# EAGLE board E8-C (EAGLE 6.6.0), part 1 of 2
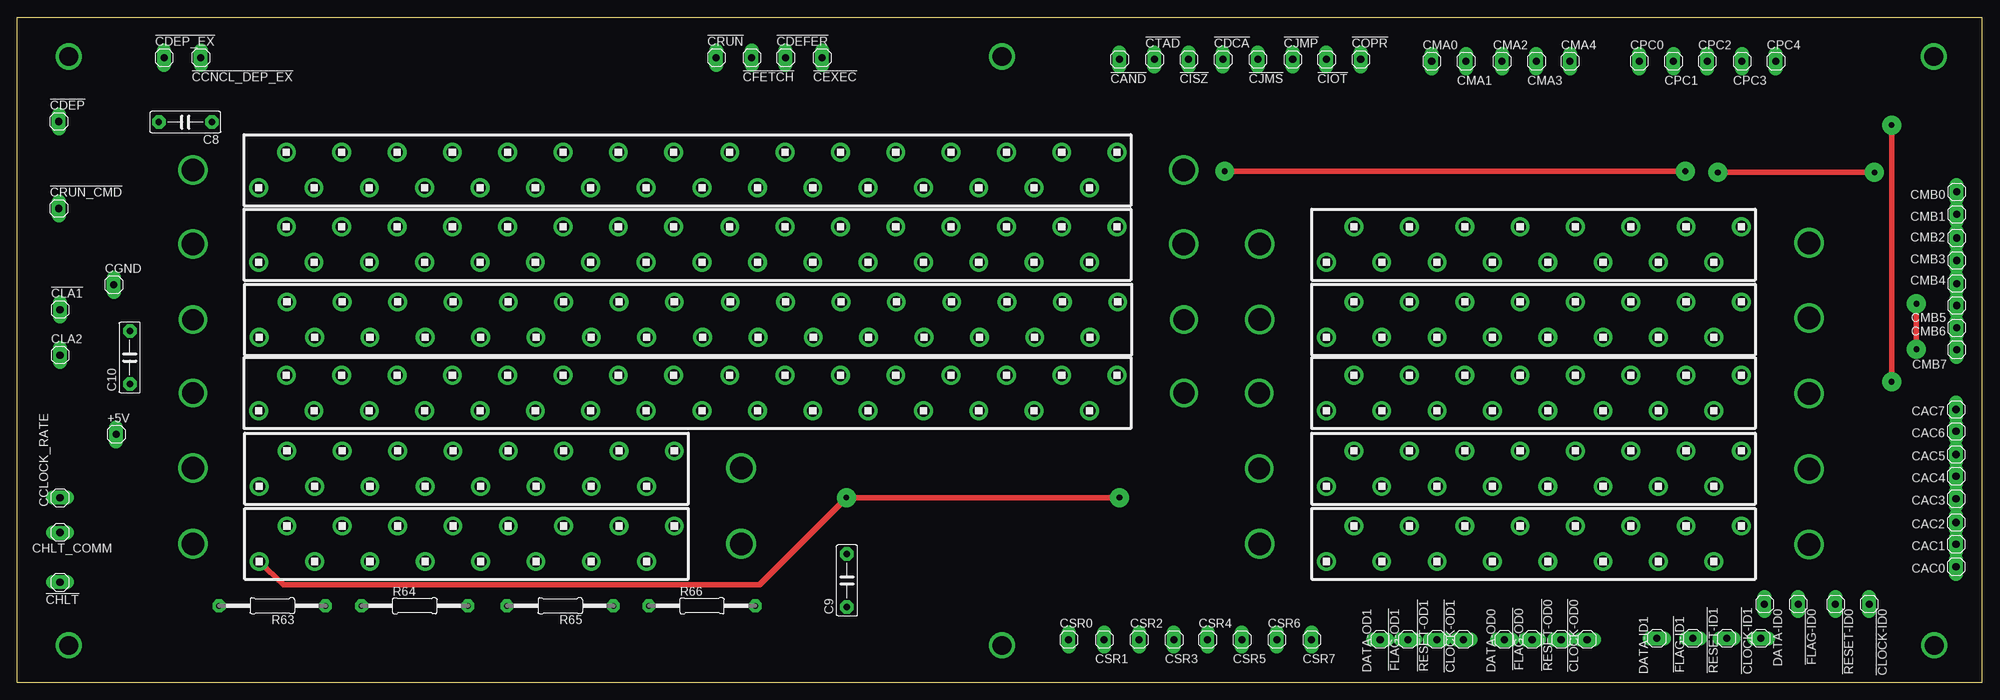
[diagram p1: board, top side]
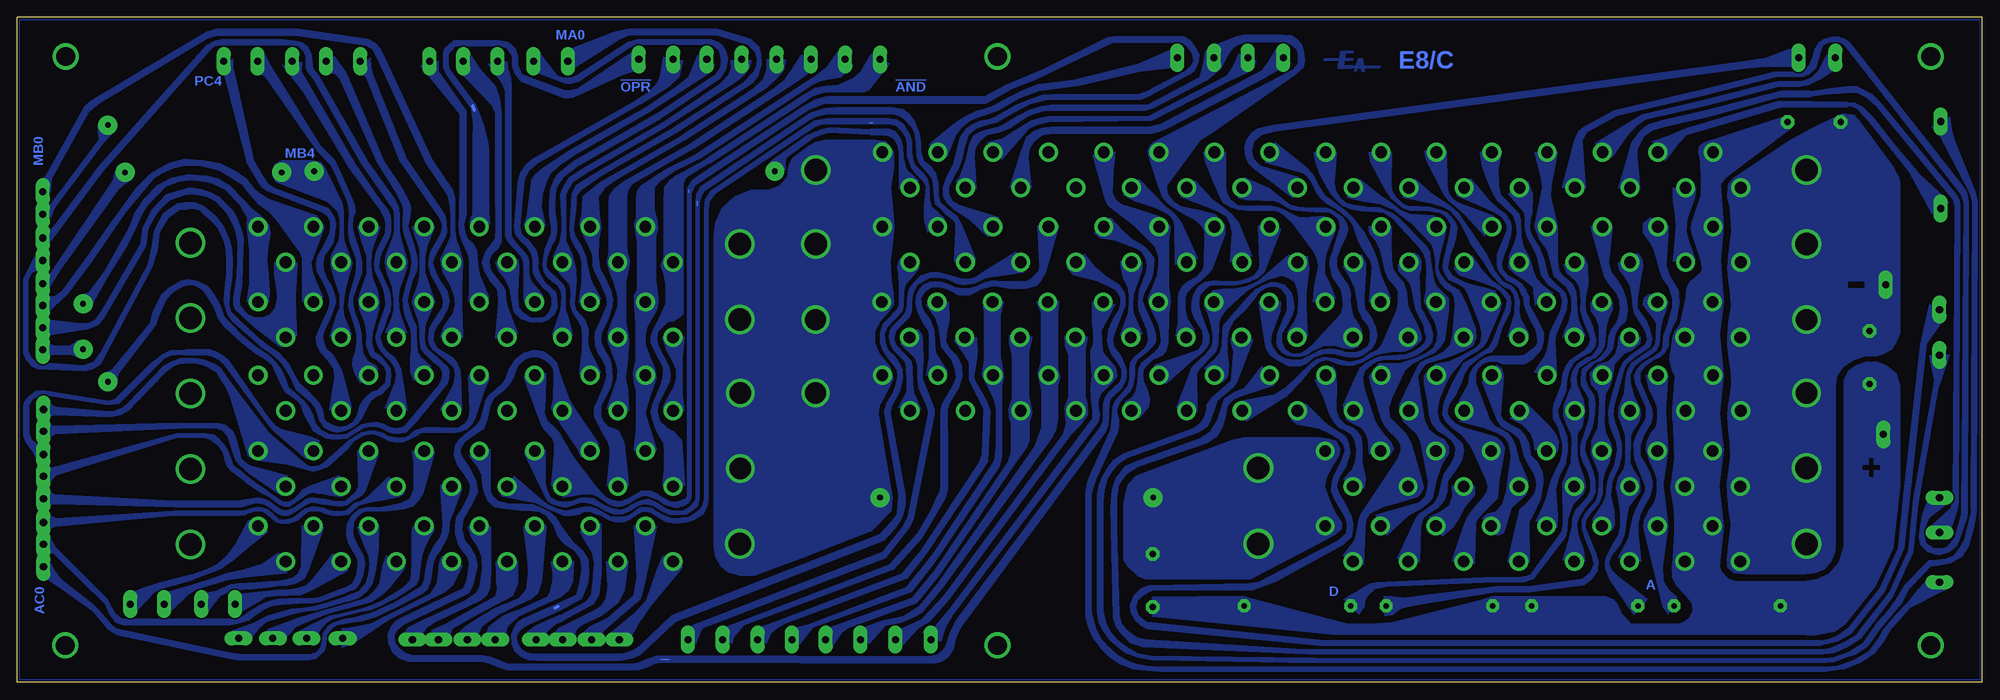
[diagram p2: board, bottom side, seen from below]

Size 281.35 x 95.17 mm. Coordinates in mm from the lower left corner, seen from the top.
Outline: 0,0 281.35,0 281.35,95.17 0,95.17 0,0
Outline: 0,0 0,0
Copper layers (1*16): Top 0.035mm / dielectric 1.5mm / Bottom 0.035mm
Design rules "default *": minimum track width 3mil, minimum drill 32mil, track to track 8mil, track to pad 8mil, pad to pad 8mil, via to via 8mil, smd to smd 8mil, copper to edge 10mil, drill to drill 8mil, minimum pad ring 20mil, minimum via ring 8mil, stop-mask expansion 4mil, vias tented up to drill 0mil, thermal gap 10mil

## Footprints (pad centres in the part's own frame; a part is rotated, then mirrored left to right if it is on the bottom)
MA01-1 = drill 1.016 long: 1 0,0
C075-032X103 = drill 0.914 octagon: 1 -3.81,0; 2 3.81,0
133-12-17 = drill 1.676: 1 -29.718,-2.54; 2 -25.756,2.54; 3 -21.793,-2.54; 4 -17.831,2.54; 5 -13.868,-2.54; 6 -9.906,2.54; 7 -5.944,-2.54; 8 -1.981,2.54; 9 1.981,-2.54; 10 5.944,2.54; 11 9.906,-2.54; 12 13.868,2.54; 13 17.831,-2.54; 14 21.793,2.54; 15 25.756,-2.54; 16 29.718,2.54
133-14-17 = drill 1.676: 1 -61.468,-2.54; 2 -57.506,2.54; 3 -53.543,-2.54; 4 -49.581,2.54; 5 -45.618,-2.54; 6 -41.656,2.54; 7 -37.694,-2.54; 8 -33.731,2.54; 9 -29.769,-2.54; 10 -25.806,2.54; 11 -21.844,-2.54; 12 -17.882,2.54; 13 -13.919,-2.54; 14 -9.957,2.54; 15 -5.994,-2.54; 16 -2.032,2.54; 17 2.032,-2.54; 18 5.994,2.54; 19 9.957,-2.54; 20 13.919,2.54; 21 17.882,-2.54; 22 21.844,2.54; 23 25.806,-2.54; 24 29.769,2.54; 25 33.731,-2.54; 26 37.694,2.54; 27 41.656,-2.54; 28 45.618,2.54; 29 49.581,-2.54; 30 53.543,2.54; 31 57.506,-2.54; 32 61.468,2.54
0207/15 = drill 0.813 octagon: 1 -7.62,0; 2 7.62,0

## Placement (x,y rotation side)
!CAND  MA01-1  [MA01-1]  157.82,89.15 0 top
!CCNCL_DEP_EX  MA01-1  [MA01-1]  26.25,89.41 0 top
!CDCA  MA01-1  [MA01-1]  172.64,89.15 0 top
!CDEFER  MA01-1  [MA01-1]  109.98,89.41 0 top
!CDEP  MA01-1  [MA01-1]  5.93,80.26 0 top
!CDEP_EX  MA01-1  [MA01-1]  21,89.41 0 top
!CEXEC  MA01-1  [MA01-1]  115.23,89.41 0 top
!CFETCH  MA01-1  [MA01-1]  105.16,89.41 0 top
!CHLT  MA01-1  [MA01-1]  6.1,14.31 90 top
!CIOT  MA01-1  [MA01-1]  187.45,89.15 0 top
!CISZ  MA01-1  [MA01-1]  167.72,89.15 0 top
!CJMP  MA01-1  [MA01-1]  182.63,89.15 0 top
!CJMS  MA01-1  [MA01-1]  177.63,89.15 0 top
!CLA1  MA01-1  [MA01-1]  6.1,53.34 0 top
!CLOCK-ID0  MA01-1  [MA01-1]  265.18,11.18 0 top
!CLOCK-ID1  MA01-1  [MA01-1]  249.68,6.27 270 top
!CLOCK-OD0  MA01-1  [MA01-1]  224.79,6.1 270 top
!CLOCK-OD1  MA01-1  [MA01-1]  207.09,6.1 270 top
!COPR  MA01-1  [MA01-1]  192.36,89.15 0 top
!CRUN  MA01-1  [MA01-1]  100.08,89.41 0 top
!CRUN_CMD  MA01-1  [MA01-1]  5.93,67.82 0 top
!CTAD  MA01-1  [MA01-1]  162.81,89.15 0 top
!FLAG-ID0  MA01-1  [MA01-1]  255.02,11.18 0 top
!FLAG-ID1  MA01-1  [MA01-1]  239.95,6.27 270 top
!FLAG-OD0  MA01-1  [MA01-1]  216.92,6.1 270 top
!FLAG-OD1  MA01-1  [MA01-1]  199.14,6.1 270 top
!RESET-ID0  MA01-1  [MA01-1]  260.35,11.18 0 top
!RESET-ID1  MA01-1  [MA01-1]  244.77,6.27 270 top
!RESET-OD0  MA01-1  [MA01-1]  221.06,6.1 270 top
!RESET-OD1  MA01-1  [MA01-1]  203.28,6.1 270 top
+5V  MA01-1  [MA01-1]  14.14,35.48 0 top
C8  0.1uF  [C075-032X103]  24.05,80.18 180 top
C9  0.1uF  [C075-032X103]  118.79,14.56 90 top
C10  0.1uF  [C075-032X103]  16.09,46.48 90 top
CAC0  MA01-1  [MA01-1]  277.62,16.51 0 top
CAC1  MA01-1  [MA01-1]  277.62,19.73 0 top
CAC2  MA01-1  [MA01-1]  277.62,22.86 0 top
CAC3  MA01-1  [MA01-1]  277.62,26.25 0 top
CAC4  MA01-1  [MA01-1]  277.62,29.46 0 top
CAC5  MA01-1  [MA01-1]  277.62,32.6 0 top
CAC6  MA01-1  [MA01-1]  277.62,35.9 0 top
CAC7  MA01-1  [MA01-1]  277.62,39.03 0 top
CCLOCK_RATE  MA01-1  [MA01-1]  6.1,26.42 90 top
CGND  MA01-1  [MA01-1]  13.8,56.9 0 top
CHLT_COMM  MA01-1  [MA01-1]  6.1,21.42 270 top
CLA2  MA01-1  [MA01-1]  6.1,46.82 0 top
CMA0  MA01-1  [MA01-1]  202.52,88.9 0 top
CMA1  MA01-1  [MA01-1]  207.43,88.9 0 top
CMA2  MA01-1  [MA01-1]  212.6,88.9 0 top
CMA3  MA01-1  [MA01-1]  217.51,88.9 0 top
CMA4  MA01-1  [MA01-1]  222.33,88.9 0 top
CMB0  MA01-1  [MA01-1]  277.71,70.19 0 top
CMB1  MA01-1  [MA01-1]  277.71,66.97 0 top
CMB2  MA01-1  [MA01-1]  277.71,63.58 0 top
CMB3  MA01-1  [MA01-1]  277.71,60.37 0 top
CMB4  MA01-1  [MA01-1]  277.71,57.07 0 top
CMB5  MA01-1  [MA01-1]  277.71,53.93 0 top
CMB6  MA01-1  [MA01-1]  277.71,50.72 0 top
CMB7  MA01-1  [MA01-1]  277.71,47.58 0 top
CPC0  MA01-1  [MA01-1]  232.24,88.9 0 top
CPC1  MA01-1  [MA01-1]  237.15,88.9 0 top
CPC2  MA01-1  [MA01-1]  241.98,88.9 0 top
CPC3  MA01-1  [MA01-1]  246.97,88.9 0 top
CPC4  MA01-1  [MA01-1]  251.8,88.9 0 top
CSR0  MA01-1  [MA01-1]  150.54,6.1 0 top
CSR1  MA01-1  [MA01-1]  155.62,6.1 0 top
CSR2  MA01-1  [MA01-1]  160.61,6.1 0 top
CSR3  MA01-1  [MA01-1]  165.61,6.1 0 top
CSR4  MA01-1  [MA01-1]  170.43,6.1 0 top
CSR5  MA01-1  [MA01-1]  175.34,6.1 0 top
CSR6  MA01-1  [MA01-1]  180.34,6.1 0 top
CSR7  MA01-1  [MA01-1]  185.34,6.1 0 top
DATA-ID0  MA01-1  [MA01-1]  250.19,11.18 0 top
DATA-ID1  MA01-1  [MA01-1]  234.78,6.27 270 top
DATA-OD0  MA01-1  [MA01-1]  212.94,6.1 270 top
DATA-OD1  MA01-1  [MA01-1]  195.16,6.1 270 top
E8/10T  MCMURDO-16  [133-12-17]  64.35,19.81 0 top
E8/10T-2  MCMURDO-16  [133-12-17]  217.17,19.81 0 top
E8/A  MCMURDO-16  [133-12-17]  64.35,30.56 0 top
E8/A-2  MCMURDO-16  [133-12-17]  217.17,30.56 0 top
E8/D  MCMURDO-32  [133-14-17]  96.01,62.65 0 top
E8/D-2  MCMURDO-16  [133-12-17]  217.17,62.65 0 top
E8/M  MCMURDO-32  [133-14-17]  96.1,51.9 0 top
E8/M-2  MCMURDO-16  [133-12-17]  217.17,51.9 0 top
E8/P  MCMURDO-32  [133-14-17]  96.01,41.4 0 top
E8/P-2  MCMURDO-16  [133-12-17]  217.17,41.4 0 top
E8/T  MCMURDO-32  [133-14-17]  96.01,73.32 0 top
R63  680  [0207/15]  36.49,10.92 180 top
R64  680  [0207/15]  56.9,10.92 0 top
R65  4700  [0207/15]  77.72,10.92 180 top
R66  4700  [0207/15]  98.04,10.92 0 top

## Tracks (layer width: path | path; a pad name or v marks a point on that pad's centre or on a via)
!CAND
  pour Bottom (no thermals): 182.12,74.34 168.49,83.23 167.56,83.9 166.37,84.33 165.44,84.5 160.1,84.5 159.43,84.84 156.46,88.56 159.09,89.92 160.61,87.29 161.63,86.44 163.75,85.43 165.52,85.34 167.13,85.01 168.99,83.9 182.88,74.76
  pour Bottom (no thermals): 188.98,28.19 188.81,29.29 188.64,30.65 188.64,33.1 188.72,34.21 189.4,35.22 189.99,36.41 190.42,37.68 190.58,38.61 190.42,39.62 189.31,42.25 188.89,43.52 188.81,44.37 188.81,45.04 189.4,46.14 190.33,47.92 190.58,48.51 190.58,49.36 190.42,50.12 189.57,51.73 189.06,52.92 188.47,54.19 188.47,56.98 188.72,58.42 189.15,59.69 188.72,60.88 188.72,68.66 188.64,70.87 187.88,71.88 186.94,72.56 182.88,74.76 182.12,74.34 183.98,73.32 185.59,72.31 186.01,71.46 186.01,52.75 186.61,52.15 187.45,51.65 188.38,51.48 189.74,50.12 189.82,49.02 189.57,48.09 188.13,45.21 187.88,44.2 187.96,43.1 189.65,39.62 189.74,38.61 189.4,37.34 188.55,36.58 187.54,35.98 186.27,34.63 185.84,28.11
!CCNCL_DEP_EX
  pour Bottom (no thermals): 98.64,69.26 104.14,73.41 105.07,74.34 105.49,75.52 105.58,76.62 105.24,77.64 104.56,78.66 103.63,79.33 101.85,79.76 33.7,88.98 30.99,89.41 27.77,90.59 26.33,90.85 26.67,88.05 30.9,88.14 34.04,87.8 101.43,78.82 103.29,78.32 104.31,77.39 104.65,76.12 104.39,75.01 103.63,74.17 103.04,73.83 97.96,72.39
!CDCA
  pour Bottom (no thermals): 185.76,77.64 173.99,85.17 172.47,86.61 171.53,87.71 171.28,89.07 174.07,89.15 174.07,87.71 174.67,86.19 176.02,84.92 186.27,78.23
  pour Bottom (no thermals): 196.93,28.02 196.51,32.17 196.51,33.53 196.77,34.46 197.53,35.73 198.2,37 198.71,38.1 198.71,39.37 198.2,40.39 197.36,42.33 196.93,43.86 197.02,45.13 197.53,46.23 198.2,47.16 198.54,48.18 198.63,49.53 198.54,50.12 197.53,52.41 196.85,54.02 196.93,55.03 197.27,55.88 197.87,57.15 198.54,58.59 198.88,59.52 198.88,60.79 199.05,61.38 199.47,62.48 200.07,63.5 200.83,65.53 200.49,66.97 200.32,69.6 197.7,71.71 186.27,78.23 185.76,77.64 195.41,72.05 197.27,70.78 198.2,69.43 198.04,66.97 197.78,65.02 198.12,63.5 198.2,60.88 197.95,59.18 197.19,57.83 196.43,56.05 196.09,54.69 196.26,53.59 196.93,51.65 197.78,49.95 197.87,48.77 197.36,47.58 196.51,46.14 196.26,44.87 196.17,43.43 196.43,42.33 196.85,41.4 197.87,39.54 197.87,38.1 197.44,37.25 196.77,36.58 195.92,36.32 195.33,36.07 194.9,35.22 194.48,34.21 193.8,28.19
!CDEFER
  pour Bottom (no thermals): 98.3,87.04 97.11,88.14 96.94,89.07 97.11,90.34 97.37,91.27 98.13,92.03 98.89,92.54 100.08,92.63 105.75,92.63 106.76,92.37 110.49,90.93 111.25,90.17 111.51,88.73 111.84,87.29 112.1,86.61 111,86.19 108.88,88.05 108.03,89.66 107.27,90.85 106.51,91.36 105.41,91.69 99.82,91.69 98.98,91.36 98.21,90.68 97.96,90 97.96,88.56 98.38,87.97 98.64,87.71
  pour Bottom (no thermals): 112.78,50.38 113.71,51.9 114.05,53.17 114.05,55.12 113.71,55.96 112.95,56.73 111.84,57.57 110.83,58.5 110.24,59.18 108.37,64.18 108.37,65.36 109.81,66.89 112.18,67.56 114.72,68.07 115.82,68.75 116.67,69.93 116.76,71.12 111.93,77.64 109.98,78.91 98.3,87.04 98.64,87.71 118.7,77.22 119.21,76.71 119.55,76.12 119.38,75.27 118.03,71.04 117.43,69.6 116.67,68.66 115.99,68.16 115.15,67.56 113.79,66.8 112.78,66.29 111.93,65.53 111.68,65.11 111.34,64.35 111.42,59.61 111.76,58.76 112.52,58 113.88,57.23 114.64,56.56 115.06,55.71 115.15,54.69 115.15,51.56 115.49,49.61
  pour Bottom (no thermals): 146.98,71.63 146.39,72.31 145.46,74.85 145.03,76.96 144.44,78.23 143.59,78.74 142.75,79.08 140.89,79.5 139.19,80.35 137.92,81.2 136.4,81.96 134.79,82.47 133.43,82.63 119.55,82.63 112.1,86.61 111,86.19 118.79,82.13 119.8,81.79 134.2,81.79 135.64,81.36 136.91,80.86 139.36,79.25 140.8,78.66 142.58,78.32 143.68,77.39 144.19,76.45 144.36,75.35 144.1,70.61
!CDEP
  pour Bottom (no thermals): 104.39,49.11 106.76,42.84 107.36,42.16 109.56,40.3 109.9,39.2 110.57,37.34 111,36.58 112.27,35.73 122.68,32 123.7,31.24 124.54,30.31 125.31,29.13 125.73,27.43 125.9,25.99 125.9,10.08 125.56,8.55 124.8,7.11 123.78,6.01 122.68,5.16 120.9,4.15 119.04,3.81 95.59,3.47 22.44,3.39 22.44,2.79 99.31,2.79 118.96,3.13 120.82,3.47 122.43,4.06 123.61,4.91 124.88,6.01 125.9,7.54 126.41,8.47 126.66,9.91 126.66,26.59 126.49,27.94 126.07,29.21 125.22,30.65 124.38,31.75 122.85,32.77 112.78,36.41 111.84,37.17 111.34,37.85 111,39.03 111,39.71 110.32,40.72 107.53,43.18 107.44,43.94 107.1,47.33 107.61,49.19
  pour Bottom (no thermals): 22.44,3.39 21.34,3.56 18.88,4.4 16.93,5.67 14.9,8.55 13.38,10.33 12.28,11.77 11.01,13.97 7.54,17.44 6.52,17.53 5.16,17.7 3.98,18.2 3.13,19.22 2.46,20.32 2.03,22.18 1.44,24.38 1.52,24.89 1.35,68.66 1.61,69.85 5.16,76.71 6.01,78.23 7.2,79.5 4.66,80.94 4.4,79.08 3.98,77.55 1.02,70.27 0.68,68.75 0.85,24.38 1.19,22.27 1.95,19.47 2.96,17.86 4.49,17.02 6.27,16.68 7.45,16.51 8.21,15.75 10.58,13.29 11.51,11.35 14.65,7.62 15.92,5.76 16.59,5 18.2,3.89 19.81,3.39 21.25,2.88 22.44,2.79
!CDEP_EX
  pour Bottom (no thermals): 55.37,77.13 50.38,80.26 48.6,81.28 39.45,83.48 29.38,86.02 25.91,86.02 24.3,86.61 23.37,87.55 22.27,89.83 20.07,88.39 23.03,86.36 24.89,85.43 26.59,85.17 29.13,85.26 39.45,82.55 48.26,80.52 49.61,79.59 50.63,78.49 53,75.18
!CEXEC
  pour Bottom (no thermals): 148.17,75.27 146.9,78.49 146.13,79.42 144.86,80.43 143.68,80.94 142.49,81.28 140.8,81.96 139.53,82.63 138.01,83.57 135.13,84.67 129.29,85.43 120.65,87.46 114.98,88.14 115.74,90.68 120.9,88.48 130.05,86.19 135.3,85.51 137.67,84.5 139.28,83.74 141.48,82.55 142.83,82.04 144.02,81.7 145.88,80.77 147.4,79.76 150.79,76.96
!CFETCH
  pour Bottom (no thermals): 142.49,77.3 140.21,77.89 137.33,79.67 136.06,80.43 134.79,80.77 133.77,81.03 119.46,81.03 108.03,86.87 107.1,86.36 118.87,80.35 133.77,80.18 135.38,79.76 136.65,79.16 140.38,74.85
  pour Bottom (no thermals): 107.1,86.36 104.9,87.46 103.89,88.9 106.51,90 107.27,88.14 108.03,86.87
!CHLT
  pour Bottom (no thermals): 22.27,2.2 20.74,2.37 18.2,3.22 16.17,4.4 14.82,6.18 13.97,7.62 12.36,9.57 10.5,11.51 9.14,13.21 7.2,15.32 5.33,13.12 10.41,10.58 12.02,8.81 13.04,7.62 14.14,5.76 15.49,4.06 17.61,2.71 19.73,1.86 20.91,1.69 22.44,1.52
  pour Bottom (no thermals): 124.8,66.46 123.27,64.77 121.92,63.58 119.97,62.31 119.3,61.64 118.62,60.71 118.7,58.84 118.96,57.91 119.46,56.81 120.14,55.37 120.31,54.61 119.97,53.68 119.38,52.49 118.7,50.97 118.36,49.78 118.36,48.77 118.79,48.09 119.72,47.16 120.99,46.14 121.41,45.3 121.41,43.94 121.58,42.59 122,41.66 122.85,40.81 123.53,40.05 123.95,39.03 123.87,38.44 123.7,37.68 123.7,36.49 123.87,35.64 126.92,29.21 127.25,28.11 127.59,26.92 127.59,10.33 127.42,9.23 127,7.7 126.32,6.35 125.39,5.25 123.87,3.89 122.68,3.22 121.16,2.62 119.63,2.37 117.86,2.2 22.27,2.2 22.44,1.52 117.86,1.52 119.63,1.61 121.58,1.86 123.27,2.46 124.8,3.47 125.98,4.66 127.25,6.27 127.93,7.96 128.35,9.4 128.35,27.09 128.1,28.45 127.59,29.8 124.71,36.15 124.54,38.1 124.46,39.45 124.12,40.3 123.44,40.98 122.6,41.99 122.26,42.5 122,43.43 122,44.62 121.92,45.72 121.67,46.14 121.24,46.65 119.89,47.84 119.38,48.77 119.38,49.45 119.55,50.38 120.65,53.09 120.82,54.1 120.73,55.29 120.57,56.22 119.63,58.67 119.55,59.69 119.72,60.71 120.23,61.55 120.9,61.98 124.12,63.16 126.24,63.58 127.08,64.26
!CIOT
  pour Bottom (no thermals): 192.02,82.8 188.04,85.34 186.52,86.78 186.01,88.98 188.89,89.49 189.4,86.53 189.99,85.43 191.09,84.33 192.62,83.4
  pour Bottom (no thermals): 209.63,60.54 209.55,59.27 209.72,55.46 209.63,53.68 208.96,52.92 207.94,52.24 206.42,52.15 205.66,52.41 205.06,53.09 204.81,54.02 204.81,54.95 205.15,55.71 206.16,56.64 206.84,57.49 207.43,58.5 207.52,59.27 207.52,60.54 207.77,61.47 208.36,62.31 209.38,63.25 209.97,64.09 210.14,65.11 209.63,71.46 209.3,72.9 208.45,74.17 207.43,75.01 192.62,83.4 192.02,82.8 207.09,74.17 208.11,73.24 208.62,72.31 208.87,71.46 209.47,65.28 209.21,64.18 207.94,62.99 207.09,61.81 206.76,60.45 206.84,59.18 206.5,58.25 205.82,57.23 204.3,55.8 204.13,54.95 204.05,53.59 204.47,52.66 205.4,51.82 206.33,51.48 207.94,51.56 209.13,51.99 210.14,52.92 210.4,53.68 210.82,56.3 211.41,57.66 212.43,58.93 212.85,60.2
!CISZ
  pour Bottom (no thermals): 184.91,77.13 172.89,85.01 171.45,86.28 169.93,88.48 169.08,89.83 166.88,88.14 169.59,86.11 184.49,76.37
  pour Bottom (no thermals): 196.93,39.12 195.75,42.5 195.41,43.6 195.33,44.79 195.66,45.97 196.77,48.77 196.77,50.12 195.33,53.76 195.33,54.69 195.41,55.54 195.92,57.23 196.51,58.67 196.93,60.11 196.6,61.47 196.6,69 196.51,69.77 195.75,70.7 194.23,71.88 184.91,77.13 184.49,76.37 190.33,73.07 193.38,71.29 193.89,70.53 194.14,69.68 194.14,62.48 194.06,61.55 193.72,60.28 193.89,59.01 194.23,57.23 194.23,51.48 193.89,49.78 193.8,48.6 194.06,45.64 194.31,43.52 193.97,41.91 193.8,38.78
!CJMP
  pour Bottom (no thermals): 191.6,82.13 187.2,85.09 185.17,86.7 183.9,89.83 181.53,88.48 182.54,87.04 190.75,81.7
  pour Bottom (no thermals): 205.74,65.45 206.25,67.99 206.16,69.85 205.57,71.63 204.89,72.9 203.79,74 201.59,75.52 190.75,81.7 191.6,82.13 202.44,76.03 205.99,73.66 207.18,72.64 207.77,71.8 207.94,70.36 208.28,67.73 208.36,66.89 208.87,65.45
!CJMS
  pour Bottom (no thermals): 188.81,80.18 180.68,85.68 179.41,86.95 179.07,87.97 179.15,89.07 176.28,89.07 176.53,88.05 177.21,87.04 178.39,86.02 188.38,79.59
  pour Bottom (no thermals): 197.78,44.37 199.39,47.58 199.64,48.51 199.56,50.55 199.98,51.73 201.25,53.17 201.59,54.1 201.25,57.32 201.34,59.1 201.85,61.21 202.78,63.16 202.78,69.77 202.35,70.61 201.76,71.63 199.64,73.07 188.38,79.59 188.81,80.18 200.32,73.49 202.35,72.22 203.28,70.7 203.62,69.77 203.45,66.21 203.45,64.69 203.71,62.99 204.64,60.96 203.88,58.67 202.27,56.98 202.1,55.96 202.18,54.1 201.93,53.09 201.25,52.07 200.66,51.05 200.49,49.95 200.49,47.84 200.91,44.11
!CLA1
  pour Bottom (no thermals): 23.2,5.93 94.15,5.93 119.63,8.55 120.82,9.48 121.16,10.75 120.9,11.77 119.97,12.62 118.87,13.12 105.66,13.21 104.39,13.21 101.09,14.48 91.44,19.73 90.25,20.91 90,22.52 90.34,23.79 91.1,25.4 92.2,27.26 92.37,28.11 91.95,29.55 91.02,30.99 90.42,32.85 90.68,34.12 91.1,35.14 93.64,36.75 94.23,37.25 96.86,39.88 98.98,37.59 98.04,36.91 94.91,36.32 93.56,35.73 92.12,34.88 91.44,34.04 91.27,33.1 91.78,31.75 92.88,29.38 93.13,28.62 93.22,27.43 92.79,26.33 91.19,23.45 90.93,22.61 91.02,21.34 91.61,20.74 92.29,20.15 103.55,14.31 104.99,14.05 119.3,13.8 120.48,13.38 121.5,12.28 122,11.09 121.92,9.99 121.41,8.97 120.48,8.13 119.55,7.62 95,5.25 23.03,5.25
  pour Bottom (no thermals): 23.2,5.93 21.84,6.18 20.57,6.69 19.05,7.79 14.56,13.46 11.94,19.22 11.18,26.59 8.81,48.34 7.45,54.1 5.08,52.58 7.96,48.43 11.18,19.13 14.05,12.87 18.88,6.86 20.74,5.76 23.03,5.25
!CLOCK-ID0
  pour Bottom (no thermals): 256.46,15.41 261.11,14.14 263.31,13.46 265.94,12.45 264.08,10.41 261.7,12.95 260.6,13.46 256.2,14.65
  pour Bottom (no thermals): 245.53,21.51 248.41,19.13 250.61,17.36 252.31,16.17 253.32,15.75 254.76,15.24 256.2,14.65 256.46,15.41 254.25,16.17 252.56,17.02 251.21,18.2 250.02,19.81 248.24,23.2
!CLOCK-ID1
  pour Bottom (no thermals): 234.02,11.6 238.42,10.33 240.2,10.08 241.64,9.82 245.79,8.55 246.72,7.79 248.58,5.42 250.53,7.45 247.65,8.47 245.62,9.48 243.67,10.08 242.06,10.5 240.37,10.67 239.01,10.84 237.32,11.26 234.27,12.28
  pour Bottom (no thermals): 232.66,22.18 232.33,21.17 231.73,19.64 231.06,18.12 230.89,17.02 231.06,15.66 231.48,14.05 232.49,12.95 234.27,12.28 234.02,11.6 232.49,12.11 231.31,13.04 230.46,14.14 229.95,16.26 229.62,19.13 229.53,22.44
!CLOCK-OD0
  pour Bottom (no thermals): 213.61,22.35 213.61,15.75 213.7,13.38 214.21,12.36 215.22,11.6 221.83,8.47 222.5,9.23 217,11.77 215.56,12.78 215.05,13.63 214.71,16.17 214.8,17.95 215.39,19.39 216.32,20.74 216.83,22.35
  pour Bottom (no thermals): 222.5,9.23 225.38,7.79 226.06,6.94 223.52,5.59 223.27,6.94 222.67,7.96 221.83,8.47
!CLOCK-OD1
  pour Bottom (no thermals): 203.71,9.57 207.09,8.04 208.36,7.11 205.91,5.5 205.49,7.28 204.3,8.38 203.37,8.72 203.2,8.81 203.62,9.57
  pour Bottom (no thermals): 197.78,22.78 197.78,15.49 198.12,12.45 198.88,11.18 203.2,8.81 203.62,9.57 199.81,11.6 199.14,12.53 198.88,14.39 198.71,16.93 198.97,18.54 200.24,20.57 200.74,21.59
!COPR
  Bottom 0.406: 215.9,81.87 216.15,82.55
  pour Bottom (no thermals): 216.58,65.79 216.07,67.14 216.07,77.72 215.98,80.01 216.32,82.13 215.73,82.63 214.71,80.09 214.04,77.39 213.87,76.12 213.87,67.31 213.7,65.53
  pour Bottom (isolate 0.254, no thermals): 215.73,82.63 219.37,87.63 219.63,88.31 219.63,90 218.61,91.1 212.01,91.1 211.24,90.76 210.48,89.66 210.48,88.14 210.14,87.21 209.63,86.53 209.21,86.02 202.95,83.57 201.76,83.74 194.9,86.87 191.69,87.97 193.29,90.17 201.17,84.92 202.27,84.67 203.12,84.75 209.04,86.95 209.63,88.31 209.63,89.58 209.97,90.59 210.65,91.27 211.24,91.61 212.34,91.86 218.86,91.86 220.22,90.59 220.39,90.09 220.39,88.05 219.96,87.12 216.32,82.13
!CRUN
  pour Bottom (no thermals): 136.14,70.78 136.57,75.1 136.4,76.28 135.81,77.47 134.54,78.4 132.93,78.57 118.87,78.57 117.77,78.91 116.42,79.42 102.45,86.7 103.12,87.55 117.6,79.84 119.46,79.42 133.35,79.42 134.54,79.33 135.81,78.91 136.91,77.98 137.67,75.78 139.28,70.87
  pour Bottom (no thermals): 103.12,87.55 102.02,88.98 101.09,90.51 99.06,88.56 102.45,86.7
!CRUN_CMD
  pour Bottom (no thermals): 45.38,74.68 43.43,77.22 42.33,78.4 28.7,82.38 19.3,82.38 19.3,83.06 29.21,83.14 42.42,79.25 44.7,78.23 47.24,77.39
  pour Bottom (no thermals): 19.3,83.06 18.2,82.97 17.19,82.47 15.66,80.86 12.53,76.88 8.89,72.64 6.35,70.27 4.74,68.66 7.11,67.06 9.4,71.29 10.33,72.98 13.46,76.88 16.51,80.69 17.78,82.04 18.71,82.47 19.3,82.38
!CTAD
  pour Bottom (no thermals): 184.15,75.61 168.57,85.85 167.22,86.7 165.44,88.05 163.91,90.17 161.71,88.31 163.58,86.53 165.35,86.28 166.54,85.94 167.81,85.34 183.64,74.93
  pour Bottom (no thermals): 193.04,33.19 192.7,36.32 192.7,41.57 193.04,43.1 193.12,44.37 192.79,46.06 192.79,51.39 192.96,54.1 192.96,55.37 192.53,56.22 192.53,62.99 192.7,63.75 192.96,65.62 192.7,66.46 192.7,69.26 192.53,70.36 191.94,71.12 188.13,73.66 184.15,75.61 183.64,74.93 187.54,72.98 189.48,71.63 190.16,70.78 190.16,67.56 189.74,66.04 189.65,64.94 189.99,63.67 189.99,57.57 189.82,56.56 189.57,54.44 189.82,53.34 191.18,50.97 191.43,49.78 191.43,48.34 190.92,46.82 190.08,44.96 189.91,43.52 190.84,40.89 191.35,39.12 191.43,38.44 191.26,37.68 189.82,33.19
!FLAG-ID0
  pour Bottom (no thermals): 237.49,22.18 239.78,15.83 240.37,14.73 241.47,14.05 242.74,13.8 244.43,13.72 244.26,14.48 242.82,14.73 241.64,15.07 241.05,15.58 240.62,16.59 240.54,22.44
  pour Bottom (no thermals): 244.26,14.48 247.06,14.22 249.77,14.05 250.78,13.97 252.9,13.04 255.61,12.53 254,10.24 252.31,12.36 251.29,12.87 250.44,13.21 247.65,13.38 244.43,13.72
!FLAG-ID1
  pour Bottom (no thermals): 229.28,10.92 230.8,10.33 232.33,9.99 236.05,9.06 237.24,8.47 238.17,7.37 238.68,5.76 240.96,7.37 239.18,8.3 237.74,8.97 236.73,9.48 235.2,9.82 233.34,10.24 231.48,10.75 229.36,11.6
  pour Bottom (no thermals): 221.57,21.93 222.67,20.07 223.18,19.05 223.52,17.78 223.86,14.82 224.28,13.97 225.81,12.87 227.41,11.85 228.35,11.43 229.28,10.92 229.36,11.6 228.52,12.02 227.67,12.53 226.31,13.38 225.47,14.05 224.96,14.82 224.79,17.1 224.79,21.51 224.71,22.35
!FLAG-OD0
  pour Bottom (no thermals): 205.66,22.44 206.25,14.56 206.84,12.7 207.94,11.77 211.24,10.33 211.58,11.18 209.47,12.11 208.45,13.21 208.2,14.9 208.11,16 208.28,18.03 208.87,22.27
  pour Bottom (no thermals): 211.58,11.18 213.19,10.41 215.05,9.31 217.34,7.87 218.27,6.94 215.73,5.5 215.31,6.43 215.14,7.28 214.71,8.04 213.78,8.81 212.43,9.74 211.24,10.33
!FLAG-OD1
  pour Bottom (no thermals): 189.82,22.35 191.69,13.63 192.19,11.85 196.17,8.47 196.85,9.14 193.04,12.45 192.62,14.99 192.7,16.85 193.04,22.44
  pour Bottom (no thermals): 196.85,9.14 199.47,7.87 200.32,7.03 197.87,5.59 197.44,7.28 196.17,8.47
!RESET-ID0
  pour Bottom (no thermals): 253.24,14.9 256.12,13.97 259.59,12.95 261.2,12.36 259.42,10.16 256.88,12.62 255.78,13.29 253.15,14.05
  pour Bottom (no thermals): 243.92,18.54 246.3,16.85 248.84,16.09 251.21,15.58 253.24,14.9 253.15,14.05 251.21,14.65 248.92,14.99 242.74,15.66
!RESET-ID1
  pour Bottom (no thermals): 231.73,11.85 236.81,10.41 239.95,9.48 241.38,9.06 242.32,8.72 245.62,7.54 243.67,5.5 241.47,7.96 240.54,8.38 238.17,9.4 236.64,9.91 231.48,11.26
  pour Bottom (no thermals): 228.52,18.12 229.02,16.76 229.53,13.97 230.12,13.12 230.97,12.28 231.73,11.85 231.48,11.26 230.72,11.51 229.28,12.45 228.77,12.87 228.01,13.63 226.23,15.83 225.81,16.43
!RESET-OD0
  pour Bottom (no thermals): 212.85,17.27 212.77,16.17 212.77,14.56 212.68,13.29 212.94,12.19 220.05,8.3 222.08,7.37 219.71,5.76 219.03,7.7 216.32,9.31 210.4,12.45 209.63,14.14 209.63,17.27
!RESET-OD1
  pour Bottom (no thermals): 197.02,17.27 196.85,13.63 197.1,11.85 197.7,10.92 198.8,10.24 197.78,9.48 195.16,11.51 194.39,13.12 193.8,17.27
  pour Bottom (no thermals): 198.8,10.24 202.52,8.38 203.88,7.7 204.55,6.86 201.93,5.67 201.17,7.62 200.66,8.13 199.64,8.64 197.78,9.48
+5V
  pour Bottom (no thermals): 25.06,6.77 23.71,6.77 21.08,7.28 19.56,8.38 15.16,13.97 12.7,19.13 11.68,28.02 11.68,42.33 12.19,44.11 13.55,45.21 14.99,45.8 16.43,45.89 17.86,45.38 19.13,44.62 19.81,43.26 19.81,19.56 20.49,17.1 21.84,15.49 23.54,14.73 25.06,14.48
  pour Bottom (no thermals): 27.18,79.42 36.75,72.22 37.51,71.2 37.08,65.28 37.51,60.37 37.08,54.44 37.59,49.78 37.08,43.94 37.59,38.52 37.08,33.19 37.68,28.02 37.08,22.35 37.59,16.59 37.34,15.83 36.41,14.82 35.14,14.48 25.06,14.48 25.06,6.77 93.05,6.77 118.79,9.4 118.79,12.19 106,12.36 93.81,9.14 90.76,8.38 86.61,8.47 84.5,8.55 71.71,11.77 70.1,12.28 53.85,12.28 52.83,11.85 52.24,11.09 51.65,9.82 50.29,8.38 43.6,8.38 42.76,8.55 41.91,9.14 41.32,10.24 41.49,11.26 42.33,12.36 43.6,13.72 44.28,14.9 44.37,16.34 44.2,17.78 44.03,21.51 44.03,23.62 44.11,25.23 44.53,27.77 44.45,28.7 44.03,32 44.11,36.41 44.28,37.85 44.28,39.12 43.94,43.77 44.37,44.7 44.7,46.23 44.2,49.61 43.86,50.46 43.18,51.14 42.33,55.12 42.25,56.39 41.74,57.32 40.3,58.59 40.05,59.01 40.13,60.11 41.49,64.18 41.66,64.85 41.57,65.62 40.22,69.68 40.22,72.05 40.3,74.59 40.56,75.78 40.47,76.62 39.79,77.3 28.11,81.11
  cutout Bottom (no thermals): 15.58,32 16.17,32 16.17,29.46 15.58,29.46
  cutout Bottom (no thermals): 15.58,32 16.17,32 16.17,29.46 15.58,29.46
CAC0
  pour Bottom (no thermals): 220.81,28.28 220.73,27.01 220.47,22.86 220.56,21.59 220.9,20.57 221.74,19.47 222.33,18.37 222.76,17.02 223.1,14.65 223.52,13.63 227.33,11.35 230.46,9.91 230.04,9.4 226.91,10.84 223.35,12.7 222.59,13.38 222.17,14.39 221.74,17.19 221.23,18.29 220.73,18.88 219.96,20.32 219.54,21.59 219.46,22.94 219.03,24.05 217.68,27.6
  pour Bottom (no thermals): 230.46,9.91 233.09,9.23 234.53,8.97 236.22,8.47 236.9,7.96 237.66,6.94 237.74,5.93 238,4.83 238.59,4.23 239.61,3.89 249.6,3.98 251.12,4.23 267.29,7.62 267.89,8.21 269.66,10.24 270.59,11.18 275.17,14.73 276.1,16 276.69,17.36 278.38,15.58 275.51,13.72 270.59,10.24 268.39,7.62 267.8,7.2 267.04,6.77 251.46,3.47 249.85,3.22 239.61,3.22 238.59,3.39 237.32,4.57 237.15,5.16 237.07,6.77 236.3,7.79 235.54,8.21 233.51,8.55 231.9,8.81 230.04,9.4
CAC1
  pour Bottom (no thermals): 221.57,33.02 223.35,27.01 223.86,26.08 224.79,25.15 225.98,24.72 228.26,24.47 229.95,24.38 231.06,24.47 231.9,24.3 232.66,23.71 233.26,22.86 233.34,21.42 233.17,20.66 232.49,19.22 231.82,18.12 231.65,16.93 231.9,15.24 232.41,14.05 233,13.29 234.36,12.78 234.61,13.46 233.34,14.14 232.75,15.24 232.58,16.59 232.58,17.53 233,18.29 233.85,19.73 234.19,21 234.1,22.61 233.34,23.96 232.24,24.81 231.31,25.06 229.53,25.06 228.01,25.32 226.31,25.65 225.04,26.33 224.54,27.6 224.54,31.5 224.79,33.1
  pour Bottom (no thermals): 234.61,13.46 238.17,12.11 239.1,11.94 242.4,11.94 244.01,11.85 245.45,11.51 246.72,10.92 247.99,10.16 249.26,9.31 250.53,8.97 266.36,8.97 267.38,9.82 268.39,11.77 275.84,19.22 276.61,20.49 277.96,18.54 276.18,18.46 275.34,17.7 268.82,11.26 268.31,9.91 267.29,8.55 266.19,8.21 250.87,8.21 249.77,8.47 248.24,8.89 247.23,9.65 245.96,10.5 244.94,10.92 243.33,11.18 241.05,11.26 238.93,11.35 238.17,11.51 234.36,12.78
CAC2
  pour Bottom (no thermals): 225.98,27.01 226.74,26.5 229.28,25.99 230.63,25.74 231.48,25.57 232.58,25.23 234.02,23.96 234.95,23.79 236.3,23.79 237.15,24.05 238.17,24.47 239.1,24.47 239.86,24.3 240.88,23.54 241.3,23.11 242.4,22.69 243.59,22.69 244.26,22.86 245.11,23.62 245.7,24.13 246.3,24.38 247.14,24.47 248.24,24.21 248.75,23.88 249.43,23.79 258.91,23.79 258.91,24.55 249.09,24.55 248.33,24.72 248.16,24.81 247.31,25.06 246.38,25.06 245.53,24.72 244.52,23.79 243.92,23.28 243.16,23.28 242.15,23.45 241.64,23.71 240.71,24.38 240.11,24.81 239.27,25.15 238.34,25.15 237.57,24.98 236.64,24.64 235.54,24.47 235.03,24.47 234.19,24.64 233,25.65 231.9,26.08 230.97,26.67 228.18,29.38
  pour Bottom (no thermals): 258.91,23.79 275.84,22.27 277.03,21.84 276.94,24.05 275.76,23.45 258.91,24.55
CAC3
  pour Bottom (no thermals): 232.66,33.19 232.58,29.04 232.58,28.02 232.92,27.18 233.68,26.5 234.44,25.91 235.63,25.82 236.39,25.99 237.32,26.16 238.17,26.25 239.18,26.42 240.03,26.16 240.88,25.57 241.55,25.06 242.49,24.64 243.25,24.55 243.84,24.81 244.6,25.32 245.28,25.91 246.04,26.16 246.89,26.42 249.51,25.99 258.83,25.91 258.83,25.15 249.26,25.15 247.23,25.65 246.72,25.65 246.04,25.48 245.19,25.06 244.18,24.21 243.42,23.88 242.49,23.88 241.55,24.38 240.96,24.81 240.2,25.32 239.52,25.65 238.76,25.74 238,25.57 237.32,25.48 236.3,25.32 235.54,25.23 234.78,25.23 234.1,25.4 233.26,26.08 232.07,26.75 231.48,27.43 229.62,32.6
  pour Bottom (no thermals): 258.83,25.91 276.01,26.84 277.03,27.43 277.2,25.32 275.93,25.57 258.83,25.15
CAC4
  pour Bottom (no thermals): 234.95,26.5 236.56,26.67 237.49,26.92 238.34,27.01 239.01,27.09 239.86,26.92 240.62,26.33 241.47,25.74 242.4,25.15 243.08,25.15 243.67,25.32 244.94,26.25 245.96,26.84 247.23,27.6 248.07,28.19 249,28.96 249.85,29.63 250.7,30.23 251.29,30.9 251.63,31.83 251.88,32.94 252.56,33.87 253.66,34.71 254.76,34.97 258.4,34.97 258.57,35.64 254.34,35.64 253.32,35.48 252.65,34.97 251.71,33.95 251.29,33.19 250.87,32.17 250.53,31.16 250.19,30.73 249.43,30.31 248.84,29.72 247.4,28.62 246.55,28.02 245.79,27.52 244.86,26.84 243.5,25.91 242.57,25.82 241.55,26.33 241.05,26.84 240.45,27.6 239.52,28.11 235.29,29.63
  pour Bottom (no thermals): 258.4,34.97 275.93,29.55 276.69,28.62 277.28,30.56 276.27,30.73 258.57,35.64
CAC5
  pour Bottom (no thermals): 238.08,34.54 239.44,35.14 243.42,36.15 244.35,36.66 245.62,38.1 251.04,45.97 251.8,46.65 252.98,47.33 253.83,47.58 257.3,47.58 257.3,46.91 254.51,46.91 253.58,46.74 252.56,46.23 251.8,45.55 245.19,36.66 244.69,35.98 243.76,35.22 239.95,31.92
  pour Bottom (no thermals): 257.3,46.91 258.06,46.91 259.42,46.74 260.43,46.31 266.87,39.88 267.8,39.71 268.73,39.71 277.54,41.06 278.21,40.98 279.23,40.47 279.74,39.71 279.74,36.07 279.65,35.48 279.4,34.71 278.47,34.04 277.54,33.87 278.64,32.09 279.06,33.02 280.08,34.37 280.42,35.31 280.42,39.62 280.33,40.13 279.74,40.89 278.55,41.74 277.62,41.83 276.27,41.57 268.31,40.3 267.29,40.56 262.21,45.64 260.43,46.99 259.5,47.5 257.3,47.58
CAC6
  pour Bottom (no thermals): 243.5,26.67 248.07,29.8 249.34,30.99 250.02,31.67 250.44,32.85 250.95,34.46 251.21,35.31 251.88,35.98 252.98,36.32 258.49,36.32 258.49,37.08 252.39,37.08 251.63,36.83 250.53,35.9 250.19,35.05 249.6,33.1 249.34,32 248.33,31.16 242.74,29.63
  pour Bottom (no thermals): 258.49,37.08 276.18,36.66 277.45,37.17 276.86,34.97 275.93,35.56 258.49,36.32
CAC7
  pour Bottom (no thermals): 213.7,43.6 214.63,41.4 215.9,37.68 216.24,37 217.09,36.15 218.02,35.81 219.03,35.64 220.56,35.73 222.67,35.73 223.69,35.64 224.37,35.14 225.38,34.63 226.31,34.29 227.41,34.37 228.09,34.46 228.77,34.88 229.7,35.31 230.55,35.48 231.82,35.31 233.17,34.46 234.1,33.36 236.98,30.73 238.17,30.31 239.01,30.14 240.28,30.48 242.65,31.16 246.89,31.67 248.24,32.26 250.78,40.81 251.38,42.16 252.14,43.26 252.73,44.28 253.83,44.96 254.76,45.38 256.03,45.64 257.3,45.64 257.3,46.4 255.61,46.4 254.51,46.14 253.32,45.64 252.31,45.04 251.54,43.86 250.7,42.67 246.8,37.59 245.36,35.73 240.79,31.75 239.86,31.07 239.1,30.9 238.08,31.07 237.32,31.5 233.85,34.63 232.83,35.31 231.99,35.81 231.06,35.98 230.04,35.98 229.02,35.73 228.43,35.31 227.16,35.05 225.98,34.97 225.13,35.39 224.37,36.07 223.01,36.49 221.91,36.58 219.63,36.41 218.19,36.41 217.17,37.08 216.66,37.85 216.49,38.95 216.75,44.03
  pour Bottom (no thermals): 257.3,46.4 258.06,46.31 259.25,45.89 260.35,45.3 265.6,39.79 266.36,39.2 267.55,38.69 269.07,38.78 275.84,39.37 276.78,39.88 277.11,37.93 276.1,38.27 267.97,38.02 266.62,38.27 265.43,38.95 264.24,40.13 260.01,44.53 259,45.3 258.15,45.55 257.3,45.64
CCLOCK_RATE
  pour Bottom (no thermals): 20.57,92.37 19.9,92.2 19.05,91.69 3.05,71.37 2.29,70.19 1.95,68.83 2.12,24.47 2.2,23.62 3.3,20.32 3.73,19.47 4.91,18.54 6.1,18.2 6.86,18.29 7.7,18.63 8.81,19.64 8.97,20.74 8.81,22.44 8.47,23.96 7.37,27.18 5.16,25.4 7.7,23.45 8.21,22.1 8.3,20.74 8.04,19.9 7.03,19.22 5.84,19.13 5,19.3 4.32,20.07 3.81,20.74 2.88,24.13 2.54,68.66 2.96,69.85 19.56,91.1 19.98,91.44 20.57,91.61
  pour Bottom (no thermals): 60.11,70.78 58.25,77.89 57.74,78.91 56.9,79.59 52.66,81.87 40.3,84.84 29.72,87.38 26.67,87.38 25.4,87.55 24.72,88.22 24.21,89.41 23.96,90.51 23.28,91.61 22.52,92.12 21.51,92.37 20.57,92.37 20.57,91.61 21.76,91.61 22.78,91.19 23.2,90.34 23.79,87.97 24.89,86.95 25.57,86.7 29.29,86.7 40.22,83.9 52.24,81.11 55.54,79.33 56.64,78.66 57.32,77.55 56.81,70.61
CHLT_COMM
  pour Bottom (no thermals): 48.94,70.7 49.36,75.18 49.36,76.28 48.26,78.32 47.07,79.08 45.38,79.59 39.37,80.94 28.87,83.82 24.55,83.82 24.55,84.58 28.79,84.58 39.62,81.79 45.89,80.35 47.58,79.84 48.26,79.42 49.02,78.82 50.21,77.22 50.88,74.93 52.07,70.78
  pour Bottom (no thermals): 24.55,84.58 21.25,85.09 19.39,85.34 17.86,85.34 17.1,84.92 15.83,84.24 14.56,82.97 3.73,69.77 3.3,69.17 3.22,68.41 3.39,25.82 3.56,24.72 4.83,20.91 7.28,22.35 4.4,24.98 4.15,25.99 3.81,67.99 4.06,69 15.07,82.47 16.51,83.65 17.78,84.33 18.46,84.41 22.69,84.07 24.55,83.82
CLA2
  pour Bottom (no thermals): 103.12,45.21 105.66,42.08 107.02,41.49 108.54,40.47 109.05,38.95 109.56,37.34 110.57,35.81 112.01,34.88 121.41,31.5 122.77,30.82 124.12,29.13 124.63,27.6 124.8,25.06 124.46,9.31 124.12,8.04 123.27,6.94 121.92,5.67 120.14,5.08 96.77,4.06 22.69,4.06 22.61,4.66 97.03,4.66 119.8,6.1 120.99,6.35 122.26,7.2 123.19,8.21 123.53,9.57 123.87,21.93 123.87,26.42 123.61,28.36 122.51,29.8 120.82,30.9 111,34.29 109.56,35.22 108.63,36.75 108.29,38.27 108.12,39.2 107.78,39.96 107.1,40.56 105.83,41.06 101.43,42.5
  pour Bottom (no thermals): 22.69,4.06 21.25,4.23 19.3,5.08 17.36,6.27 12.7,12.36 9.82,18.63 9.14,25.57 6.27,42.08 5.76,43.43 4.66,46.91 7.54,46.74 6.86,43.18 9.82,26.25 10.58,18.8 13.38,12.7 14.22,11.6 16.93,8.13 18.03,6.69 19.39,5.84 21.42,4.91 22.61,4.66
CMA0
  pour Bottom (no thermals): 187.03,78.66 176.11,85.85 175.26,86.78 174.75,88.39 174.84,90 175.09,90.85 176.36,92.03 181.1,93.47 193.8,93.47 195.92,93.05 203.28,90.17 201.51,88.05 195.07,92.12 193.72,92.71 181.27,92.71 176.78,91.36 175.68,90.25 175.43,89.15 175.51,88.31 175.94,87.29 177.38,85.85 187.45,79.33
  pour Bottom (no thermals): 197.78,54.86 199.22,57.57 199.73,59.61 199.9,60.88 200.49,62.23 201.42,63.75 201.68,64.94 201.42,67.14 201.25,68.5 201.25,69.68 200.66,70.53 197.53,72.64 193.29,75.1 187.03,78.66 187.45,79.33 198.04,73.15 201.42,71.04 202.01,69.85 202.27,64.69 202.1,63.58 201.59,62.48 200.83,61.3 200.58,60.2 200.58,57.32 201,54.36
CMA1
  pour Bottom (no thermals): 189.91,81.28 181.36,86.95 180.68,87.88 180.51,89.07 180.76,90.42 181.69,91.19 192.62,91.27 193.8,90.76 201.08,85.94 202.18,85.6 202.86,85.68 208.11,87.71 206.5,90 205.66,88.82 204.13,86.87 203.03,86.53 202.18,86.53 201.17,86.87 193.8,91.69 192.53,92.03 181.95,92.03 180.93,91.61 180.42,91.19 179.92,90.34 179.66,89.24 179.92,87.71 180.76,86.36 189.31,80.69
  pour Bottom (no thermals): 201.76,49.7 202.52,52.41 202.86,53.34 202.86,56.3 203.12,56.81 204.13,57.83 205.06,58.67 205.57,59.27 205.57,60.03 205.4,60.88 204.72,62.74 204.3,63.5 204.05,64.52 204.05,65.62 204.39,67.31 204.39,68.83 204.22,70.53 203.79,71.46 203.12,72.39 201.17,73.83 189.31,80.69 189.91,81.28 201.76,74.51 203.37,73.24 203.96,72.73 204.55,71.88 205.06,70.53 205.23,68.5 205.23,66.72 204.89,65.19 204.89,64.18 205.82,61.98 206.08,60.71 206.16,59.69 205.99,58.84 205.4,58 204.81,57.4 203.96,56.81 203.54,56.13 203.45,55.12 203.54,53.34 204.81,49.78
CMA2
  pour Bottom (no thermals): 211.41,84.58 211.84,85.68 212.77,86.95 213.95,88.56 211.24,88.9 211.16,87.8 210.74,86.53 210.65,85.34
  pour Bottom (no thermals): 208.79,54.44 208.79,59.44 208.96,60.45 209.3,61.13 210.06,61.98 211.07,63.08 211.41,63.84 211.41,84.58 210.65,85.34 210.65,64.01 210.31,63.25 208.36,61.04 208.11,60.28 208.11,58.59 207.86,57.49 206.16,55.37
CMA3
  pour Bottom (no thermals): 212.09,81.96 212.26,83.48 212.77,85.17 215.14,87.8 216.32,89.58 218.44,87.88 213.44,82.63 212.85,81.36
  pour Bottom (no thermals): 212.85,49.19 212.43,54.02 212.43,54.95 212.6,56.22 213.61,57.4 214.38,58.76 214.8,60.11 214.55,60.96 214.21,61.72 212.85,63.5 212.77,65.11 212.77,66.21 212.85,70.02 212.85,81.36 212.09,81.96 212.09,63.08 212.51,62.15 213.44,61.3 213.78,60.45 213.7,59.27 213.36,58.59 211.75,56.56 211.5,55.96 211.41,54.78 211.16,53.59 209.72,49.87
CMA4
  pour Bottom (no thermals): 216.75,54.53 216.58,55.71 216.58,59.94 216.66,60.96 217.25,62.23 217.68,63.16 218.02,64.26 218.1,65.53 218.02,66.72 218.02,67.48 217.93,71.04 217.93,81.28 217.09,81.79 217.09,66.89 217.42,65.62 217.34,64.52 216.92,63.5 216.07,62.74 215.56,61.72 215.48,59.77 215.22,58.42 213.78,54.95
  pour Bottom (no thermals): 217.09,81.79 221.06,87.38 221.06,88.9 223.6,88.22 217.93,81.28
CMB0
  pour Bottom (no thermals): 217.51,49.36 217.68,53.93 217.68,56.47 217.51,60.37 218.02,62.15 218.52,63.58 218.69,64.85 218.69,69.26 218.95,70.36 221.83,74.59 222.93,74.51 219.79,69.85 219.46,68.5 219.29,66.97 219.29,63.84 219.71,62.82 220.81,60.54 220.47,58.67 219.37,56.81 218.78,55.29 218.69,54.02 219.03,52.66 220.3,50.88 220.81,49.45
  pour Bottom (no thermals): 221.83,74.59 229.28,90.51 230.12,91.44 231.22,92.03 241.05,93.47 252.9,93.47 254.34,93.05 270.85,83.14 271.78,82.38 277.37,72.39 278.55,71.12 276.61,70.19 276.44,72.05 271.1,81.7 269.58,82.97 254.17,92.2 252.73,92.63 241.55,92.63 231.39,91.19 230.55,90.68 229.95,89.58 222.93,74.51
CMB1  (via drill 0.81 pad 2.71)
  Top 0.813: v268.39,43.01 v268.39,79.76 | v268.39,43.01
  pour Bottom (no thermals): 267.38,78.99 268.99,77.3 276.1,67.9 276.61,66.55 277.62,68.24 276.69,68.24 269.66,77.64 269.83,79.76
  pour Bottom (no thermals): 221.57,65.28 222.67,62.57 223.01,60.88 223.01,58.67 222.42,56.73 221.57,54.44 222.93,51.22 223.1,49.53 223.01,48.34 222.59,47.67 221.4,46.57 219.88,45.21 219.54,44.62 219.63,43.6 219.79,42.76 224.28,37.25 225.81,35.73 226.65,35.56 227.5,35.56 228.18,35.81 229.28,36.32 230.04,36.58 230.89,36.58 231.82,36.32 232.58,35.9 233.43,35.39 234.19,34.88 235.8,34.71 237.15,34.88 238.17,35.39 239.01,35.98 239.52,37 240.2,38.18 240.71,39.71 241.22,40.3 241.98,40.89 242.91,41.49 243.33,42.25 244.35,44.37 244.77,45.38 245.7,46.14 247.14,46.99 249.09,48.51 250.7,49.95 251.71,50.97 252.48,51.9 253.24,53.85 254.08,55.2 254.76,56.13 255.95,56.73 256.96,56.81 257.73,56.64 259.08,55.8 259.59,56.47 257.89,57.49 256.88,57.66 255.61,57.49 254.17,56.73 253.24,55.54 252.48,54.19 251.71,52.24 250.7,51.14 249.26,49.7 247.48,48.18 245.53,46.91 244.86,46.31 244.26,45.64 243.59,44.7 242.99,43.43 242.57,42.25 241.64,41.4 240.96,40.81 240.37,40.3 239.61,39.29 239.1,38.18 238.76,37.17 237.91,36.15 236.81,35.56 235.37,35.39 234.1,35.56 233.17,36.15 231.99,36.91 230.97,37.17 229.95,37.25 228.94,37 228.09,36.58 227.16,36.32 226.31,36.49 225.72,36.75 220.81,42.76 220.47,43.69 220.47,44.53 220.9,45.13 221.74,45.8 222.76,46.82 223.44,47.58 223.69,48.94 223.69,50.63 223.86,51.73 224.37,53.17 224.79,54.44 224.45,55.63 223.94,56.9 223.69,58.42 223.69,61.81 223.94,62.74 224.79,65.19
  pour Bottom (no thermals): 259.08,55.8 260.1,54.78 261.28,52.15 261.54,51.14 266.95,44.11 267.12,42.76 268.48,44.37 267.63,44.87 262.3,51.48 261.96,52.83 260.69,55.46 259.59,56.47
CMB2
  pour Bottom (no thermals): 228.6,50.04 227.67,52.15 227.41,53.42 227.41,54.78 227.58,56.56 228.43,58.67 228.68,60.11 228.52,61.13 227.58,63.5 227.33,64.52 227.33,66.72 227.41,67.48 227.67,67.99 232.07,74.25 231.22,74.51 227.33,69.17 226.82,68.16 226.65,67.06 226.65,64.69 226.57,63.75 225.98,61.72 225.55,60.37 225.64,59.27 226.65,56.22 226.82,54.95 226.74,53.59 226.57,52.58 225.64,50.04
  pour Bottom (no thermals): 232.07,74.25 238.93,86.36 239.69,87.29 240.03,88.05 240.03,89.58 240.37,90.34 241.05,91.02 242.06,91.19 252.14,91.19 253.15,91.02 253.75,90.51 269.24,73.07 276.69,62.99 277.62,64.77 276.61,64.77 276.1,65.28 269.66,73.83 262.47,81.96 254.17,91.27 253.07,91.86 252.14,92.03 243.33,92.03 241.55,91.86 240.62,91.61 239.86,91.02 239.27,89.83 239.1,87.8 238.25,86.87 231.22,74.51
CMB3
  pour Bottom (no thermals): 232.66,65.28 232.16,63.16 231.31,60.96 231.31,58.5 232.24,55.8 232.58,54.86 232.41,53.42 231.65,51.56 231.31,49.7 231.39,48.18 231.06,47.24 230.63,46.57 229.79,46.06 228.85,45.21 228.52,44.37 228.6,42.84 229.87,41.74 230.63,41.49 231.65,40.56 232.33,39.54 232.75,38.02 233.34,37.17 234.27,36.66 235.29,36.49 236.22,36.75 237.15,37.25 237.41,37.68 237.57,38.86 238,39.79 239.69,41.66 240.37,42.25 240.96,42.76 241.55,43.86 242.32,45.3 243.08,46.23 243.92,47.16 245.45,48.18 246.63,49.11 247.48,49.78 249.26,51.48 250.7,52.92 251.04,53.85 250.95,55.54 250.61,58 250.53,60.11 250.61,61.98 251.04,63.5 251.71,65.11 252.98,66.72 254.68,68.16 255.95,68.66 257.47,68.66 258.4,68.5 258.15,67.65 257.22,67.73 256.2,67.82 255.19,67.56 254.42,66.8 253.58,66.12 252.81,65.28 252.22,64.18 251.71,62.99 251.54,61.98 251.46,60.45 251.46,58.34 251.71,55.71 251.8,54.53 251.63,53.68 251.29,52.75 250.7,51.82 249.17,50.46 247.82,49.28 246.38,47.92 245.03,47.07 243.76,45.97 242.99,44.96 242.23,43.69 241.89,42.67 241.47,41.91 240.2,40.89 239.35,40.13 238.76,39.45 238.51,38.61 238.17,37.59 237.41,36.49 236.64,36.07 235.63,35.81 234.53,35.98 233.51,36.41 232.66,37 232.07,37.68 231.48,38.78 230.72,40.39 229.87,40.98 229.19,41.23 228.01,42.59 227.84,43.86 227.92,44.79 228.6,45.8 229.28,46.57 230.21,47.24 230.55,48.43 230.55,49.36 230.38,50.38 229.62,53.09 229.45,54.36 229.79,56.13 230.46,57.91 230.72,59.61 230.63,61.47 230.21,62.91 229.36,65.11
  pour Bottom (no thermals): 258.4,68.5 259.42,67.82 260.52,66.97 261.79,64.69 262.13,62.31 262.72,59.77 269.49,47.07 270.43,45.8 271.95,45.3 275.93,45.55 278.55,45.72 279.32,46.4 279.82,47.41 279.82,57.57 279.23,58.67 278.47,59.01 277.71,59.18 278.98,60.88 279.57,59.52 280.16,58.5 280.5,57.66 280.5,47.07 280.16,46.23 279.23,45.21 278.47,44.87 271.7,44.62 270.59,44.87 269.58,45.47 269.07,46.23 262.04,59.44 261.28,61.81 260.94,64.52 259.76,66.46 258.15,67.65
CMB4  (via drill 0.81 pad 2.71)
  Top 0.813: v172.89,73.15 v238.84,73.15 | 243.84,72.98 v243.5,72.98 243.84,72.98 | 243.84,72.98 265.43,72.98 | 265.43,72.98 v265.94,72.98 265.43,72.98
  pour Bottom (no thermals): 152.32,71.8 153.84,73.15 154.18,73.83 154.43,75.1 154.52,76.62 154.86,77.81 155.62,78.82 156.46,79.16 159.17,79.16 159.17,78.4 157.14,78.4 156.38,78.15 155.79,77.81 155.36,77.05 155.11,75.95 155.11,70.61
  pour Bottom (no thermals): 159.17,78.4 165.18,78.66 166.54,78.23 167.56,77.81 171.28,75.1 171.45,74.51 171.45,73.32 173.57,74.51 168.15,78.4 166.29,79.16 164.93,79.42 159.17,79.16
  pour Bottom (no thermals): 233.51,49.87 234.53,52.49 234.7,53.59 234.53,54.86 234.36,56.3 233.34,59.94 233.76,61.13 234.53,63.25 234.61,64.52 234.61,67.56 234.87,68.66 235.88,70.7 237.24,73.49 237.91,74.42 239.01,74.68 243.5,74.68 244.6,74.08 244.86,72.56 244.35,71.63 236.98,68.83 236.14,68.07 235.54,67.48 235.2,66.38 235.2,64.69 235.29,63.42 236.47,60.96 236.47,59.52 235.97,57.74 235.2,55.46 235.2,53.59 235.63,52.66 236.64,49.53
  pour Bottom (no thermals): 267.04,73.91 267.46,72.81 267.63,71.88 276.44,58.76 276.78,58.34 277.71,58.25 276.78,56.47 275.25,59.01 266.87,70.61 266.02,71.29 265.01,71.97
CMB5
  pour Bottom (no thermals): 237.57,55.2 238.59,57.4 239.1,58.76 239.27,59.94 238.93,60.96 237.32,65.11 238.51,66.8 245.19,69.09 246.3,69.68 247.31,70.44 248.5,71.97 249.17,71.29 248.07,69.93 246.89,68.5 245.36,67.39 244.35,66.38 240.96,61.64 240.54,60.71 240.54,54.44
  pour Bottom (no thermals): 248.5,71.97 250.19,73.15 252.31,74.25 254.76,74.68 257.47,74.85 259.76,74.25 262.3,72.81 264.33,70.7 267.89,65.79 271.27,60.96 274.91,55.96 276.01,55.2 277.62,55.2 276.94,53 274.24,55.54 270.51,60.54 266.02,67.06 261.79,72.22 260.6,72.9 259,73.66 257.22,74 254.93,73.91 252.39,73.32 249.17,71.29
CMB6
  pour Bottom (no thermals): 252.48,69.43 253.66,70.1 254.93,70.53 256.71,70.78 257.64,70.53 260.01,69.77 262.13,67.56 263.4,65.11 263.57,64.09 263.74,62.65 268.9,53.76 270.17,51.9 271.02,51.39 272.46,51.31 277.62,51.99 277.54,49.61 271.19,50.63 269.75,51.14 268.9,52.24 262.97,62.4 262.81,62.91 262.72,64.52 262.47,65.19 261.37,67.23 260.69,67.99 259.5,69.09 257.47,69.77 256.2,69.93 254.34,69.6 252.9,68.83
  pour Bottom (no thermals): 241.3,60.03 241.55,55.29 241.47,52.41 241.38,49.61 243.67,47.92 247.4,50.8 250.11,53.34 250.36,54.1 250.36,55.03 249.85,58.08 249.77,62.91 250.02,64.43 250.53,65.7 251.29,67.14 252.9,68.83 252.48,69.43 250.53,67.48 249.94,66.46 249.34,64.94 249,63.58 249.17,59.77 249.26,56.9 249.6,54.86 249.51,53.93 248.5,52.75 247.48,52.24 246.13,52.24 245.11,52.66 244.35,53.59 244.09,55.03 244.18,56.13 244.52,58.34 244.52,60.2
CMB7  (via drill 0.81 pad 2.71)
  Top 0.813: v271.95,47.67 v271.95,54.19
  pour Bottom (no thermals): 272.46,46.4 273.73,46.91 276.18,46.91 277.2,46.57 277.28,48.77 276.01,48.18 273.73,48.26 272.63,48.94
  pour Bottom (no thermals): 245.28,54.44 245.19,55.88 245.36,58.34 245.62,60.45 245.45,62.23 245.11,64.26 245.28,65.45 246.55,66.8 247.73,67.73 248.92,69 250.95,71.04 251.46,70.44 249.6,68.5 249,67.48 248.41,66.63 248.5,65.28 248.16,61.98 248.16,56.98 248.5,54.53
  pour Bottom (no thermals): 251.46,70.44 253.58,71.46 255.1,71.71 256.79,71.88 258.4,71.54 260.27,70.87 261.37,69.68 262.72,68.33 263.65,66.89 264.24,65.36 265.68,62.48 268.39,58.08 270.43,54.61 270.76,53.42 272.12,55.54 271.1,55.8 268.82,58.76 266.53,62.82 265.26,65.11 264.5,67.23 263.23,69.17 261.2,71.2 259.33,72.22 256.88,72.73 254.08,72.47 252.73,72.14 250.95,71.04
CPC0
  pour Bottom (no thermals): 217.68,38.95 217.85,44.62 218.36,45.72 219.12,46.48 220.13,47.07 221.23,47.84 221.74,48.85 221.66,50.12 221.23,51.05 220.56,51.99 219.71,53.42 219.46,54.44 219.71,55.88 220.73,57.32 221.49,58.84 221.91,60.11 221.49,61.21 220.05,63.75 219.79,64.52 219.88,65.7 220.05,66.63 220.64,67.73 225.55,74.76 226.65,74.76 221.23,66.97 220.73,66.21 220.56,65.28 220.73,64.18 222.17,61.72 222.42,60.88 222.5,59.69 222.17,58.42 221.4,57.07 220.64,55.54 220.39,54.61 220.47,53.68 221.06,52.83 221.91,51.48 222.42,50.63 222.5,49.19 222.33,48.26 221.83,47.58 220.56,46.57 219.71,45.97 218.86,45.13 218.69,44.03 218.86,42.67 220.9,39.03
  pour Bottom (no thermals): 225.55,74.76 230.38,86.95 230.72,88.14 230.8,89.32 233.17,87.8 231.48,86.78 226.65,74.76
CPC1
  pour Bottom (no thermals): 224.54,43.18 225.04,44.45 225.04,46.23 224.87,47.67 224.87,49.7 225.04,50.63 225.72,52.24 226.06,53.68 226.14,54.95 225.64,56.98 225.04,58.67 224.79,60.03 224.96,61.3 225.64,63.16 226.06,64.52 226.14,65.62 226.06,67.65 226.23,68.5 227.16,70.27 229.79,74.34 228.94,74.59 226.4,70.87 225.3,68.83 225.04,67.9 225.21,66.55 225.47,65.28 225.13,64.09 224.62,62.65 224.2,60.96 224.11,59.77 224.28,58.67 224.79,57.57 225.3,55.71 225.55,54.61 225.3,53.68 224.79,52.15 224.28,50.97 224.28,49.36 224.11,47.41 223.77,46.65 222.17,45.21
  pour Bottom (no thermals): 229.79,74.34 235.03,86.28 235.63,86.95 237.66,87.55 235.97,89.58 234.36,87.29 228.94,74.59
CPC2
  pour Bottom (no thermals): 228.68,39.2 227.16,43.01 227.08,44.11 227.25,45.04 227.75,45.8 228.68,46.74 229.45,47.67 229.87,48.51 230.04,49.36 229.87,50.12 229.62,50.97 228.85,53.09 228.52,54.1 228.68,55.29 228.94,56.3 229.53,57.74 230.04,58.76 230.21,59.86 230.04,61.04 229.79,62.06 229.02,63.5 228.6,64.26 228.52,65.62 228.68,66.29 229.28,67.48 233.76,73.58 233,74.17 229.45,69.09 228.35,67.65 228.01,66.8 227.92,65.87 227.92,64.52 228.18,63.58 228.68,62.57 229.28,61.47 229.53,60.45 229.62,59.35 229.11,58.25 228.77,57.4 228.18,56.22 228.01,55.37 227.92,54.36 228.01,53.17 228.43,52.24 228.85,50.88 229.19,50.12 229.45,49.45 229.28,48.68 229.02,48.01 228.26,47.16 227.41,46.48 226.91,45.72 226.48,44.87 226.31,43.94 226.14,42.67 225.55,38.86
  pour Bottom (no thermals): 233.76,73.58 240.45,84.58 242.82,87.63 243.33,88.31 240.62,88.82 240.71,87.38 239.95,86.02 233,74.17
CPC3
  pour Bottom (no thermals): 229.7,44.79 230.04,45.3 231.22,45.97 231.65,46.65 231.82,47.24 232.07,48.94 232.07,49.95 232.49,51.56 233,52.92 233.26,53.93 233.26,55.03 232.83,56.22 232.41,57.49 231.99,58.59 231.99,60.2 232.24,61.38 232.58,62.48 233.09,63.84 233.34,65.02 233.26,66.46 232.92,67.31 233,68.24 233.68,69.93 234.87,72.47 235.63,74.25 235.88,74.68 237.91,76.71 238.42,76.12 236.47,74.08 235.8,72.56 235.03,70.95 234.36,69.34 234.02,68.33 233.85,67.06 233.93,66.12 234.02,65.45 234.02,64.35 233.76,62.99 233.17,61.47 232.83,60.45 232.83,59.52 232.92,58.42 233.76,55.63 233.93,54.78 234.02,53.76 233.6,52.66 233,50.63 232.75,49.7 232.75,48.68 233,47.33 233.34,46.31 233.43,45.38 233.09,44.2 232.24,42.84
  pour Bottom (no thermals): 237.91,76.71 245.03,88.14 245.79,89.75 247.9,88.05 247.06,87.29 245.87,86.78 238.42,76.12
CPC4
  pour Bottom (no thermals): 236.64,38.95 235.88,43.77 235.97,44.79 236.9,46.14 237.83,47.16 238.42,48.26 238.59,49.36 238.08,50.63 236.81,53.42 236.56,54.36 236.64,55.2 237.07,56.22 237.66,57.49 238.42,58.84 238.51,59.86 238.34,60.88 237.24,62.91 236.56,64.35 236.47,65.02 236.47,65.96 236.9,66.8 237.74,67.31 245.53,70.27 246.3,70.87 246.8,71.54 248.5,74.51 247.48,74.51 246.38,72.64 245.62,71.46 244.77,70.87 236.9,67.9 235.97,66.55 235.8,65.53 235.97,64.01 236.14,62.91 236.73,62.06 237.41,61.04 237.66,59.86 237.49,58.84 237.07,57.74 236.39,56.73 235.97,55.54 235.8,54.53 236.05,53.51 236.64,51.99 237.41,50.38 237.74,49.36 237.24,47.84 236.22,46.91 235.46,45.64 234.95,44.62 233.51,39.2
  pour Bottom (no thermals): 247.48,74.51 250.19,86.87 250.44,87.97 250.44,89.24 252.48,87.8 251.71,86.95 248.5,74.51
CSR0
  pour Bottom (no thermals): 124.21,54.1 125.14,52.24 125.81,51.05 126.15,50.21 126.07,48.01 125.9,47.16 124.97,46.06 124.12,45.04 124.04,44.53 123.87,43.77 124.71,42.76 126.24,41.32 126.58,40.39 126.58,39.37 126.41,38.18 126.66,37.17 147.4,9.65 147.74,10.58 127.34,37.76 127.34,38.78 127.51,40.64 127.59,42.08 127.42,43.86 127.59,46.31 127.59,47.58 127.25,48.26 127.17,49.19 127.25,50.29 127.42,51.48 127.42,54.44
  pour Bottom (no thermals): 147.4,9.65 148.51,7.79 149.18,5.76 151.81,7.11 149.78,8.04 147.74,10.58
CSR1
  pour Bottom (no thermals): 128.1,49.45 128.44,47.58 128.44,40.89 128.19,39.96 128.1,38.27 129.03,36.91 130.56,35.39 148.25,11.51 148.51,12.53 131.57,35.48 131.15,37 131.23,38.44 131.32,39.29 130.73,40.89 130.73,46.74 131.23,48.18 131.32,49.61
  pour Bottom (no thermals): 148.25,11.51 150.79,8.64 152.48,7.62 154.6,5.25 156.21,7.54 154.52,7.79 151.72,9.06 148.51,12.53
CSR2
  pour Bottom (no thermals): 149.35,14.31 152.15,10.84 154.52,9.4 157.4,8.81 161.37,7.37 159.43,5.5 157.06,8.13 154.77,8.55 152.65,9.48 151.81,9.99 148.93,13.46
  pour Bottom (no thermals): 132.16,54.61 132.42,52.83 132.42,44.96 132.08,43.69 132.42,42.5 132.42,37.59 132.67,36.07 133.18,35.05 148.93,13.46 149.35,14.31 135.64,33.7 135.13,35.14 134.62,36.41 134.62,41.83 134.87,42.67 135.21,44.28 134.7,45.89 134.7,52.92 135.38,54.44
CSR3
  pour Bottom (no thermals): 149.86,16.09 153.25,12.02 165.95,7.45 164.59,5.16 163.24,7.11 162.39,7.79 152.57,11.35 152.06,11.94 149.61,14.99